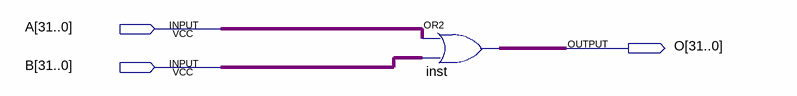
[diagram p0: schematic sheet]
// Quartus schematic testing.bdf as structural Verilog: 1 symbols, 3 pins
module testing (
  input  [31:0] A,
  input  [31:0] B,
  output [31:0] O
);

  assign O = A | B;  // OR2 inst, 32 bits wide
endmodule
